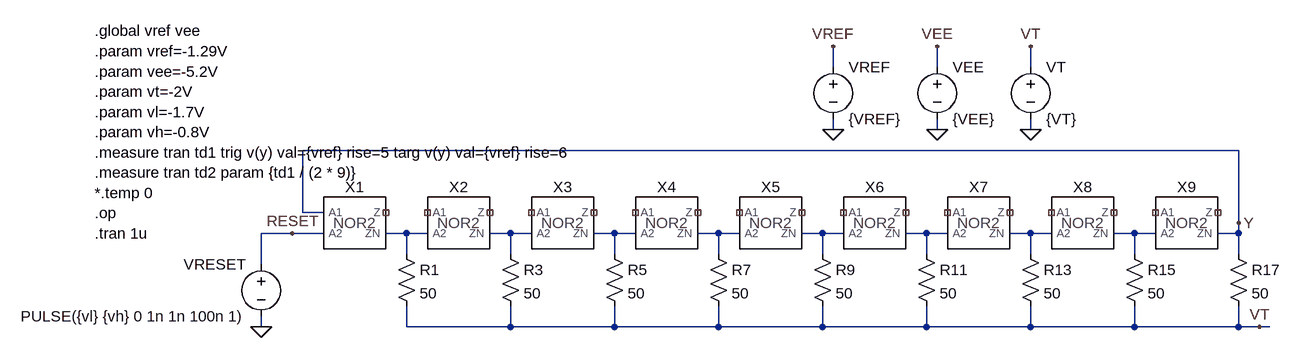
[diagram p0: schematic tb_ringosc9.asc]
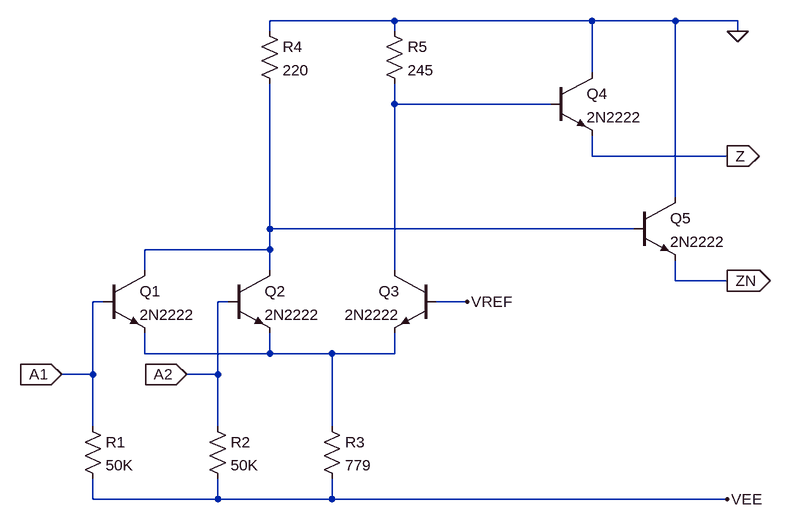
[diagram p1: sub-circuit nor2.asc]
tb_ringosc9.asc, the LTspice schematic file:
Version 4
SHEET 1 2604 704
WIRE 1184 144 1184 112
WIRE 1344 144 1344 112
WIRE 1488 144 1488 112
WIRE 1184 240 1184 224
WIRE 1344 240 1344 224
WIRE 1488 240 1488 224
WIRE 1808 272 368 272
WIRE 368 368 368 272
WIRE 400 368 368 368
WIRE 1808 384 1808 272
WIRE 352 400 304 400
WIRE 400 400 352 400
WIRE 528 400 496 400
WIRE 560 400 528 400
WIRE 688 400 656 400
WIRE 720 400 688 400
WIRE 848 400 816 400
WIRE 880 400 848 400
WIRE 1008 400 976 400
WIRE 1040 400 1008 400
WIRE 1168 400 1136 400
WIRE 1200 400 1168 400
WIRE 1328 400 1296 400
WIRE 1360 400 1328 400
WIRE 1488 400 1456 400
WIRE 1520 400 1488 400
WIRE 1648 400 1616 400
WIRE 1680 400 1648 400
WIRE 1808 400 1808 384
WIRE 1808 400 1776 400
WIRE 528 432 528 400
WIRE 688 432 688 400
WIRE 848 432 848 400
WIRE 1008 432 1008 400
WIRE 1168 432 1168 400
WIRE 1328 432 1328 400
WIRE 1488 432 1488 400
WIRE 1648 432 1648 400
WIRE 1808 432 1808 400
WIRE 304 448 304 400
WIRE 304 544 304 528
WIRE 528 544 528 512
WIRE 688 544 688 512
WIRE 688 544 528 544
WIRE 848 544 848 512
WIRE 848 544 688 544
WIRE 1008 544 1008 512
WIRE 1008 544 848 544
WIRE 1168 544 1168 512
WIRE 1168 544 1008 544
WIRE 1328 544 1328 512
WIRE 1328 544 1168 544
WIRE 1488 544 1488 512
WIRE 1488 544 1328 544
WIRE 1648 544 1648 512
WIRE 1648 544 1488 544
WIRE 1808 544 1808 512
WIRE 1808 544 1648 544
WIRE 1840 544 1808 544
WIRE 1856 544 1840 544
FLAG 1184 240 0
FLAG 1344 240 0
FLAG 1184 112 VREF
FLAG 1344 112 VEE
FLAG 1488 240 0
FLAG 1488 112 VT
FLAG 1808 384 Y
FLAG 304 544 0
FLAG 352 400 RESET
FLAG 1840 544 VT
SYMBOL nor2 448 384 R0
SYMATTR InstName X1
SYMBOL voltage 1184 128 R0
SYMATTR InstName VREF
SYMATTR Value {VREF}
SYMBOL voltage 1344 128 R0
SYMATTR InstName VEE
SYMATTR Value {VEE}
SYMBOL res 512 416 R0
SYMATTR InstName R1
SYMATTR Value 50
SYMBOL voltage 1488 128 R0
SYMATTR InstName VT
SYMATTR Value {VT}
SYMBOL nor2 608 384 R0
SYMATTR InstName X2
SYMBOL res 672 416 R0
SYMATTR InstName R3
SYMATTR Value 50
SYMBOL nor2 768 384 R0
SYMATTR InstName X3
SYMBOL res 832 416 R0
SYMATTR InstName R5
SYMATTR Value 50
SYMBOL nor2 928 384 R0
SYMATTR InstName X4
SYMBOL res 992 416 R0
SYMATTR InstName R7
SYMATTR Value 50
SYMBOL nor2 1088 384 R0
SYMATTR InstName X5
SYMBOL res 1152 416 R0
SYMATTR InstName R9
SYMATTR Value 50
SYMBOL nor2 1248 384 R0
SYMATTR InstName X6
SYMBOL res 1312 416 R0
SYMATTR InstName R11
SYMATTR Value 50
SYMBOL nor2 1408 384 R0
SYMATTR InstName X7
SYMBOL res 1472 416 R0
SYMATTR InstName R13
SYMATTR Value 50
SYMBOL nor2 1568 384 R0
SYMATTR InstName X8
SYMBOL res 1632 416 R0
SYMATTR InstName R15
SYMATTR Value 50
SYMBOL nor2 1728 384 R0
SYMATTR InstName X9
SYMBOL res 1792 416 R0
SYMATTR InstName R17
SYMATTR Value 50
SYMBOL voltage 304 432 M0
SYMATTR InstName VRESET
SYMATTR Value PULSE({vl} {vh} 0 1n 1n 100n 1)
TEXT 48 88 Left 2 !.global vref vee\n.param vref=-1.29V\n.param vee=-5.2V\n.param vt=-2V\n.param vl=-1.7V\n.param vh=-0.8V\n.measure tran td1 trig v(y) val={vref} rise=5 targ v(y) val={vref} rise=6\n.measure tran td2 param {td1 / (2 * 9)}\n*.temp 0\n.op\n.tran 1u

nor2.asc, the sub-circuit schematic file:
Version 4
SHEET 1 1476 680
WIRE 544 -272 352 -272
WIRE 848 -272 544 -272
WIRE 976 -272 848 -272
WIRE 1072 -272 976 -272
WIRE 352 -256 352 -272
WIRE 544 -256 544 -272
WIRE 1072 -256 1072 -272
WIRE 848 -192 848 -272
WIRE 544 -144 544 -176
WIRE 784 -144 544 -144
WIRE 848 -64 848 -96
WIRE 1056 -64 848 -64
WIRE 976 0 976 -272
WIRE 352 48 352 -176
WIRE 912 48 352 48
WIRE 352 80 352 48
WIRE 352 80 160 80
WIRE 160 112 160 80
WIRE 352 112 352 80
WIRE 544 112 544 -144
WIRE 976 128 976 96
WIRE 1056 128 976 128
WIRE 96 160 80 160
WIRE 288 160 272 160
WIRE 656 160 608 160
WIRE 160 240 160 208
WIRE 352 240 352 208
WIRE 352 240 160 240
WIRE 448 240 352 240
WIRE 544 240 544 208
WIRE 544 240 448 240
WIRE 80 272 80 160
WIRE 80 272 32 272
WIRE 272 272 272 160
WIRE 272 272 224 272
WIRE 80 352 80 272
WIRE 272 352 272 272
WIRE 448 352 448 240
WIRE 80 464 80 432
WIRE 272 464 272 432
WIRE 272 464 80 464
WIRE 448 464 448 432
WIRE 448 464 272 464
WIRE 1056 464 448 464
FLAG 1072 -256 0
FLAG 656 160 VREF
FLAG 1056 464 VEE
FLAG 32 272 A1
IOPIN 32 272 In
FLAG 224 272 A2
IOPIN 224 272 In
FLAG 1056 128 ZN
IOPIN 1056 128 Out
FLAG 1056 -64 Z
IOPIN 1056 -64 Out
SYMBOL npn 96 112 R0
SYMATTR InstName Q1
SYMATTR Value 2N2222
SYMBOL npn 288 112 R0
SYMATTR InstName Q2
SYMATTR Value 2N2222
SYMBOL npn 608 112 M0
SYMATTR InstName Q3
SYMATTR Value 2N2222
SYMBOL res 64 336 R0
SYMATTR InstName R1
SYMATTR Value 50K
SYMBOL res 256 336 R0
SYMATTR InstName R2
SYMATTR Value 50K
SYMBOL res 432 336 R0
SYMATTR InstName R3
SYMATTR Value 779
SYMBOL res 336 -272 R0
SYMATTR InstName R4
SYMATTR Value 220
SYMBOL res 528 -272 R0
SYMATTR InstName R5
SYMATTR Value 245
SYMBOL npn 784 -192 R0
SYMATTR InstName Q4
SYMATTR Value 2N2222
SYMBOL npn 912 0 R0
SYMATTR InstName Q5
SYMATTR Value 2N2222

The netlist it stands for:
* tb_ringosc9.asc
XX1 Y RESET NC_01 N001 nor2
VREF VREF 0 {VREF}
VEE VEE 0 {VEE}
R1 N001 VT 50
VT VT 0 {VT}
XX2 NC_02 N001 NC_03 N002 nor2
R3 N002 VT 50
XX3 NC_04 N002 NC_05 N003 nor2
R5 N003 VT 50
XX4 NC_06 N003 NC_07 N004 nor2
R7 N004 VT 50
XX5 NC_08 N004 NC_09 N005 nor2
R9 N005 VT 50
XX6 NC_10 N005 NC_11 N006 nor2
R11 N006 VT 50
XX7 NC_12 N006 NC_13 N007 nor2
R13 N007 VT 50
XX8 NC_14 N007 NC_15 N008 nor2
R15 N008 VT 50
XX9 NC_16 N008 NC_17 Y nor2
R17 Y VT 50
VRESET RESET 0 PULSE({vl} {vh} 0 1n 1n 100n 1)

* block symbol definitions
.subckt nor2 A1 A2 Z ZN
Q1 N002 A1 N003 0 2N2222
Q2 N002 A2 N003 0 2N2222
Q3 N001 VREF N003 0 2N2222
R1 A1 VEE 50K
R2 A2 VEE 50K
R3 N003 VEE 779
R4 0 N002 220
R5 0 N001 245
Q4 0 N001 Z 0 2N2222
Q5 0 N002 ZN 0 2N2222
.ends nor2

.model NPN NPN
.model PNP PNP
.lib standard.bjt
.global vref vee
.param vref=-1.29V
.param vee=-5.2V
.param vt=-2V
.param vl=-1.7V
.param vh=-0.8V
.measure tran td1 trig v(y) val={vref} rise=5 targ v(y) val={vref} rise=6
.measure tran td2 param {td1 / (2 * 9)}
*.temp 0
.op
.tran 1u
.backanno
.end